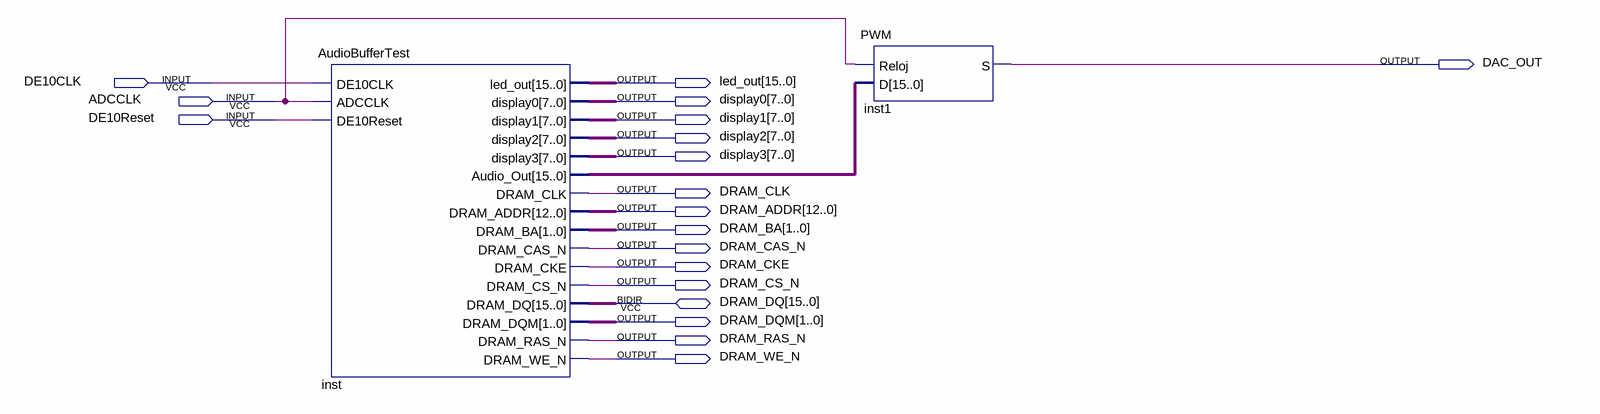
[diagram p0: schematic sheet]
// Quartus schematic AudioBufferWout.bdf as structural Verilog: 2 symbols, 19 pins
module AudioBufferWout (
  input  DE10CLK,
  input  ADCCLK,
  input  DE10Reset,
  inout  [15:0] DRAM_DQ,
  output DAC_OUT,
  output [15:0] led_out,
  output [7:0] display0,
  output [7:0] display1,
  output [7:0] display2,
  output [7:0] display3,
  output DRAM_CLK,
  output [12:0] DRAM_ADDR,
  output [1:0] DRAM_BA,
  output DRAM_CAS_N,
  output DRAM_CKE,
  output DRAM_CS_N,
  output [1:0] DRAM_DQM,
  output DRAM_RAS_N,
  output DRAM_WE_N
);

  wire [15:0] inst_audio_out;

  AudioBufferTest inst (
    .DE10CLK(DE10CLK), .ADCCLK(ADCCLK), .DE10Reset(DE10Reset), .led_out(led_out), .display0(display0),
    .display1(display1), .display2(display2), .display3(display3), .Audio_Out(inst_audio_out),
    .DRAM_CLK(DRAM_CLK), .DRAM_ADDR(DRAM_ADDR), .DRAM_BA(DRAM_BA), .DRAM_CAS_N(DRAM_CAS_N),
    .DRAM_CKE(DRAM_CKE), .DRAM_CS_N(DRAM_CS_N), .DRAM_DQM(DRAM_DQM), .DRAM_RAS_N(DRAM_RAS_N),
    .DRAM_WE_N(DRAM_WE_N), .DRAM_DQ(DRAM_DQ));
  PWM inst1 (.Reloj(ADCCLK), .D(inst_audio_out), .S(DAC_OUT));
endmodule
